# Altium schematic sheet Calculator_Sch.SchDoc
size A4; SheetNumber: 1; SheetTotal: 1
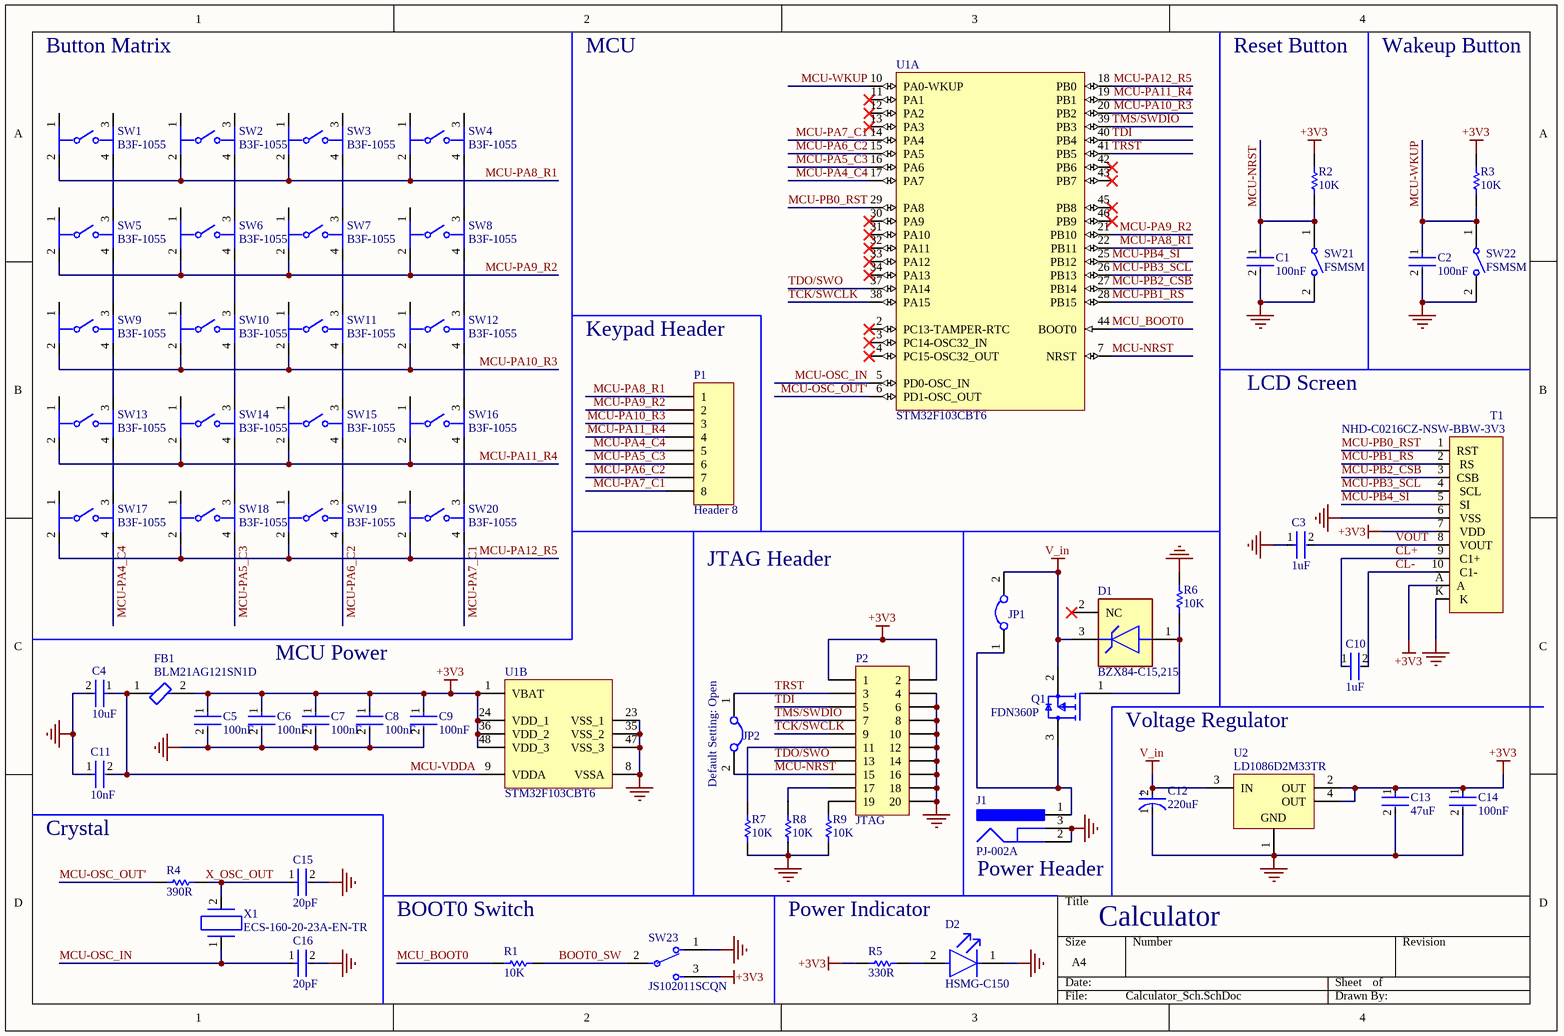
[diagram p0: Calculator_Sch.SchDoc]

## Parts
C1  100nF  [FP-C1206C-EB-MFG]
C2  100nF  [FP-C1206C-EB-MFG]
C3  1uF  [FP-1206-L_3_2_0_2-W_1_6_0-IPC_C]
C4  10uF  [FP-1206-L_3_2_0_2-W_1_6_0-IPC_B]
C5  100nF  [FP-C1206C-EB-MFG]
C6  100nF  [FP-C1206C-EB-MFG]
C7  100nF  [FP-C1206C-EB-MFG]
C8  100nF  [FP-C1206C-EB-MFG]
C9  100nF  [FP-C1206C-EB-MFG]
C10  1uF  [FP-1206-L_3_2_0_2-W_1_6_0-IPC_C]
C11  10nF  [FP-C1206C-EB-MFG]
C12  220uF  [FP-TAJE-MFG]
C13  47uF  [FP-C3216-160-0_2-MFG]
C14  100nF  [FP-C1206C-EB-MFG]
C15  20pF  [FP-C1206C-EB-MFG]
C16  20pF  [FP-C1206C-EB-MFG]
D1  BZX84-C15,215  [FP-SOT23-IPC_C]
D2  HSMG-C150  [FP-HSMG-C150-MFG]
FB1  BLM21AG121SN1D  [FP-BLM21-0_2-t0_85-e0_5-IPC_A]
J1  PJ-002A  [CUI-PJ-002A_V]
JP1  Jumper  [Jumper Small - 2.54 - GRAY]  (value not drawn)
JP2  Jumper  [Jumper Small - 2.54 - GRAY]  (value not drawn)
P1  Header 8  [HDR1X8]
P2  JTAG  [HDR2X10]
Q1  FDN360P  [FP-527AG-IPC_B]
R1  10K  [RESC3116X65X40ML10T20]
R2  10K  [RESC3116X65X40ML10T20]
R3  10K  [RESC3116X65X40ML10T20]
R4  390R  [RESC3216X60X45NL10T20]
R5  330R  [RESC3116X65X40LL10T20]
R6  10K  [RESC3116X65X40ML10T20]
R7  10K  [RESC3116X65X40ML10T20]
R8  10K  [RESC3116X65X40ML10T20]
R9  10K  [RESC3116X65X40ML10T20]
SW1  B3F-1055  [FP-B3F-1055-MFG]
SW2  B3F-1055  [FP-B3F-1055-MFG]
SW3  B3F-1055  [FP-B3F-1055-MFG]
SW4  B3F-1055  [FP-B3F-1055-MFG]
SW5  B3F-1055  [FP-B3F-1055-MFG]
SW6  B3F-1055  [FP-B3F-1055-MFG]
SW7  B3F-1055  [FP-B3F-1055-MFG]
SW8  B3F-1055  [FP-B3F-1055-MFG]
SW9  B3F-1055  [FP-B3F-1055-MFG]
SW10  B3F-1055  [FP-B3F-1055-MFG]
SW11  B3F-1055  [FP-B3F-1055-MFG]
SW12  B3F-1055  [FP-B3F-1055-MFG]
SW13  B3F-1055  [FP-B3F-1055-MFG]
SW14  B3F-1055  [FP-B3F-1055-MFG]
SW15  B3F-1055  [FP-B3F-1055-MFG]
SW16  B3F-1055  [FP-B3F-1055-MFG]
SW17  B3F-1055  [FP-B3F-1055-MFG]
SW18  B3F-1055  [FP-B3F-1055-MFG]
SW19  B3F-1055  [FP-B3F-1055-MFG]
SW20  B3F-1055  [FP-B3F-1055-MFG]
SW21  FSMSM  [TECO-FSMSM-2_V]
SW22  FSMSM  [TECO-FSMSM-2_V]
SW23  JS102011SCQN  [FP-JS102011SCQN-MFG]
T1  NHD-C0216CZ-NSW-BBW-3V3  [NHD-C0216CZ-NSW-BBW-3V3]
U1  STM32F103CBT6  [STM-LQFP48_L]  (parts A,B of 2)
U2  LD1086D2M33TR  [D2PAK_A_L]
X1  ECS-160-20-23A-EN-TR  [ECX-64AEN/64CEN]

## Nets
+3V3: C5.1 C6.1 C7.1 C8.1 C9.1 C13.1 C14.1 FB1.2 P2.1 P2.2 R2.2 R3.2 R5.1 SW23.3 T1.7(VDD) T1.A U1.1(VBAT) U1.24(VDD_1) U1.36(VDD_2) U1.48(VDD_3) U2.2(OUT) U2.4(OUT)
GND: C1.2 C2.2 C3.1 C4.2 C5.2 C6.2 C7.2 C8.2 C9.2 C11.1 C12.1(C) C13.2 C14.2 C15.2 C16.2 D2.1(C) J1.2 J1.3 P2.4 P2.6 P2.8 P2.10 P2.12 P2.14 P2.16 P2.18 P2.20 R6.1 R7.1 R8.1 R9.1 SW21.2 SW22.2 SW23.1 T1.6(VSS) T1.K U1.8(VSSA) U1.23(VSS_1) U1.35(VSS_2) U1.47(VSS_3) U2.1(GND)
V_in: C12.2(A) D1.3(C) JP1.2 Q1.2(S) U2.3(IN)
BOOT0_SW: R1.2 SW23.2(C)
CL+: C10.1 T1.9(C1+)
CL-: C10.2 T1.10(C1-)
MCU-NRST: C1.1 JP2.2 P2.15 R2.1 SW21.1 U1.7(NRST)
MCU-OSC_IN: C16.1 U1.5(PD0-OSC_IN) X1.1
MCU-OSC_OUT': R4.1 U1.6(PD1-OSC_OUT)
MCU-PA4_C4: P1.5 SW17.4 U1.17(PA7)
MCU-PA5_C3: P1.6 SW18.4 U1.16(PA6)
MCU-PA6_C2: P1.7 SW19.4 U1.15(PA5)
MCU-PA7_C1: P1.8 SW20.4 U1.14(PA4)
MCU-PA8_R1: P1.1 SW1.2 SW2.2 SW3.2 SW4.2 U1.22(PB11)
MCU-PA9_R2: P1.2 SW5.2 SW6.2 SW7.2 SW8.2 U1.21(PB10)
MCU-PA10_R3: P1.3 SW9.2 SW10.2 SW11.2 SW12.2 U1.20(PB2)
MCU-PA11_R4: P1.4 SW13.2 SW14.2 SW15.2 SW16.2 U1.19(PB1)
MCU-PA12_R5: SW17.2 SW18.2 SW19.2 SW20.2 U1.18(PB0)
MCU-PB0_RST: T1.1(RST) U1.29(PA8)
MCU-PB1_RS: T1.2(RS) U1.28(PB15)
MCU-PB2_CSB: T1.3(CSB) U1.27(PB14)
MCU-PB3_SCL: T1.4(SCL) U1.26(PB13)
MCU-PB4_SI: T1.5(SI) U1.25(PB12)
MCU-VDDA: C4.1 C11.2 FB1.1 U1.9(VDDA)
MCU-WKUP: C2.1 R3.1 SW22.1 U1.10(PA0-WKUP)
MCU_BOOT0: R1.1 U1.44(BOOT0)
TCK/SWCLK: P2.9 U1.38(PA15)
TDI: P2.5 U1.40(PB4)
TDO/SWO: P2.13 U1.37(PA14)
TMS/SWDIO: P2.7 U1.39(PB3)
TRST: JP2.1 P2.3 U1.41(PB5)
VOUT: C3.2 T1.8(VOUT)
X_OSC_OUT: C15.1 R4.2 X1.2
NetD1_1: D1.1(A) Q1.1(G) R6.2
NetD2_2: D2.2(A) R5.2
NetJ1_1: J1.1 JP1.1 Q1.3(D)
NetP2_11: P2.11 R7.2
NetP2_17: P2.17 R8.2
NetP2_19: P2.19 R9.2
NetSW1_4: SW1.4 SW5.3
NetSW2_4: SW2.4 SW6.3
NetSW3_4: SW3.4 SW7.3
NetSW4_4: SW4.4 SW8.3
NetSW5_4: SW5.4 SW9.3
NetSW6_4: SW6.4 SW10.3
NetSW7_4: SW7.4 SW11.3
NetSW8_4: SW8.4 SW12.3
NetSW9_4: SW9.4 SW13.3
NetSW10_4: SW10.4 SW14.3
NetSW11_4: SW11.4 SW15.3
NetSW12_4: SW12.4 SW16.3
NetSW13_4: SW13.4 SW17.3
NetSW14_4: SW14.4 SW18.3
NetSW15_4: SW15.4 SW19.3
NetSW16_4: SW16.4 SW20.3

Not connected (* = marked no-connect by the designer): D1 2(NC)*; SW1 1 3; SW2 1 3; SW3 1 3; SW4 1 3; SW5 1; SW6 1; SW7 1; SW8 1; SW9 1; SW10 1; SW11 1; SW12 1; SW13 1; SW14 1; SW15 1; SW16 1; SW17 1; SW18 1; SW19 1; SW20 1; U1 2(PC13-TAMPER-RTC)* 3(PC14-OSC32_IN)* 4(PC15-OSC32_OUT)* 11(PA1)* 12(PA2)* 13(PA3)* 30(PA9)* 31(PA10)* 32(PA11)* 33(PA12)* 34(PA13)* 42(PB6)* 43(PB7)* 45(PB8)* 46(PB9)*

## Notes on the sheet
- Button Matrix
- MCU
- Reset Button
- Wakeup Button
- Keypad Header
- LCD Screen
- JTAG Header
- MCU Power
- (near JP2) Default Setting: Open
- Voltage Regulator
- Crystal
- (near R1) BOOT0 Switch
- Power Indicator
- (near J1) Power Header
- Calculator
- (in symbol CMP-04424-000272-1) +

## Library data of the parts
C1 C2 C5-C9 C14 = CMP-03020-021070-1: CAP CER 0.1UF 16V 10% X7R 1206; Manufacturer Part Number: C1206C104K4RACTU; Manufacturer: KEMET; Automotive Grade: Grade 0; Tolerance: 0.1; Temperature Coefficient: 15%; Capacitance: 0.10 μF; Material: Ceramic; Value: 0.10 μF; ComponentLink2URL: https://content.kemet.com/datasheets/KEM_C1007_X8R_ULTRA_150C_SMD.pdf; Voltage Rating: 16 V; Temperature Range Low: -55°C; Device Class L3: Ceramic Capacitors; Device Class L1: Passive Components; Lead Free: Yes; Temperature Characteristic: X7R; Package: C1206C-EB; RoHS: TRUE; Ipc Land Pattern Name: CAPC320160X78; Automotive: Yes; Temperature: -55°C to +150°C; Category: Cap; Digikey Description: CAP CER 0.1UF 16V 10% X7R 1206; Mouser Description: Multilayer Ceramic Capacitors MLCC - SMD/SMT 16volts 0.1uF X7R 10%; ComponentLink2Description: Datasheet; Temperature Range High: +150°C; Device Class L2: Capacitors; Height: 0.88mm; Octopart: https://octopart.com/c1206c104k4ractu-kemet-12577600
C3 C10 = CMP-04427-011211-1: General Purpose Ceramic Capacitor, 1206, 1uF, 20%, X7R, 15%, 16V; Dissipation Factor: 3.5%; Contact Plating: Tin; Case Code (Imperial): 1206; Dielectric: X7R; Packaging: Tape and Reel; Case/Package: 1206; Min Operating Temperature: -55°C; Radiation Hardening: No; Length: 3.2mm; Termination: SMD/SMT; Number of Pins: 2; Lead Free: Lead Free; Case Code (Metric): 3216; Tolerance: 20%; Series: -; RoHS Compliant: Yes; Capacitance: 1uF; REACH SVHC: No SVHC; Max Operating Temperature: 125°C; Thickness: 0.05inch; Mount: Surface Mount; Depth: 1.6mm; Construction: Flat; Width: 1.6mm; Package Quantity: 1; Voltage Rating (DC): 16V; Voltage Rating: 16V
C4 = CMP-04427-000082-1: General Purpose Ceramic Capacitor, 1206, 10uF, 10%, X5R, 15%, 16V; Max Operating Temperature: 85°C; Tolerance: 10%; Dielectric: X5R; Series: -; Case Code (Imperial): 1206; Width: 1.6mm; Termination: SMD/SMT; Voltage Rating: 16V; REACH SVHC: No SVHC; Length: 3.2mm; Size: 1.78mm; Capacitance: 10uF; Package Quantity: 1; Voltage: 16V; RoHS Compliant: Yes; Thickness: 0.07inch; Mount: Surface Mount; Radiation Hardening: No; Voltage Rating (DC): 16V; Min Operating Temperature: -55°C; Case Code (Metric): 3216; Construction: Flat; Depth: 1.6mm; Height: 0.07mm; Lead Free: Lead Free; Number of Pins: 2; Case/Package: 1206; Packaging: Tape and Reel
C11 = CMP-1037-03529-2: CAP CER 10000PF 200V X7R 1206; Manufacturer: KEMET; Manufacturer Part Number: C1206C103K2RACTU; Value: 10,000 pF; Automotive Grade: Grade 0; Temperature Coefficient: 15%; Material: Ceramic; Tolerance: 0.1; Temperature Range High: +150°C; Category: Cap; Device Class L2: Capacitors; Temperature Range Low: -55°C; Temperature Characteristic: X7R; Lead Free: Yes; Octopart: https://octopart.com/c1206c103k2ractu-kemet-2299149; Device Class L1: Passive Components; RoHS: TRUE; Mouser Description: Multilayer Ceramic Capacitors MLCC - SMD/SMT 200volts 10000pF X7R 10%; Temperature: -55°C to +150°C; Voltage Rating: 200 V; ComponentLink2URL: https://content.kemet.com/datasheets/KEM_C1007_X8R_ULTRA_150C_SMD.pdf; Ipc Land Pattern Name: CAPC320160X78; Automotive: Yes; Device Class L3: Ceramic Capacitors; Digikey Description: CAP CER 10000PF 200V X7R 1206; Capacitance: 10,000 pF; Package: C1206C-EB; ComponentLink2Description: Datasheet; Height: 0.88mm
C12 = CMP-04424-000272-1: 220uF 16V  ±20% 500mΩ 2917  SMD Tantalum Capacitor; ESR (Equivalent Series Resistance): 500mR; Polarity: Polar; Leakage Current: 35.2uA; Dissipation Factor: 10%; Width: 4.3mm; Depth: 4.3mm; Termination: SMD/SMT; Radiation Hardening: No; RoHS Compliant: Yes; Mount: Surface Mount; Packaging: Tape and Reel; Voltage Rating (DC): 16V; Tolerance: 20%; Features: General Purpose; Case Code (Imperial): 2917; Lead Free: Lead Free; REACH SVHC: No SVHC; Series: TAJ; Voltage Rating: 16V; Construction: Flat; Number of Pins: 2; Length: 7.3mm; Capacitance: 220uF; Min Operating Temperature: -55°C; Package Quantity: 1; Max Operating Temperature: 125°C; Case/Package: 2917; Height - Seated (Max): 0.169inch; Case Code (Metric): 7343; Height: 4.3mm
C13 = CMP-2000-07442-2: Multilayer Ceramic Capacitors 47uF ±20% 16V X5R SMD 1206; Resistor Type: Ceramic; Width: 0.063inch; Case Code (Imperial): 1206; Radiation Hardening: No; Thickness: 0.071inch; Dielectric: X5R; Weight: 0.000571oz; Termination: SMD/SMT; Dielectric Material: Ceramic; Min Operating Temperature: -55°C; Depth: 1.6mm; Case Code (Metric): 3216; Max Operating Temperature: 85°C; RoHS Compliant: Yes; REACH SVHC: No SVHC; Mount: Surface Mount; Lead Free: Lead Free; Height: 1.6mm; Length: 3.2mm; Tolerance: 20%; Voltage Rating (DC): 16V; Capacitance: 47uF; Package Quantity: 1; Construction: Flat; Packaging: Tape and Reel; Series: C; Case/Package: 1206; Voltage Rating: 16V
C15 C16 = CMP-1037-00940-2: 1206 C 20pF Ceramic Multilayer Capacitor; 50 VDC; +125degC; C0G Dielec; +/-5%; Manufacturer: KEMET; Manufacturer Part Number: C1206C200J5GACTU; Temperature Coefficient: 15%; Automotive Grade: Grade 0; Voltage Rating: 50 V; Tolerance: 0.05; Material: Ceramic; Category: Cap; Mouser Description: 1206 C 20pF Ceramic Multilayer Capacitor; 50 VDC; +125degC; C0G Dielec; +/-5%; Device Class L1: Passive Components; Digikey Description: 1206 C 20pF Ceramic Multilayer Capacitor; 50 VDC; +125degC; C0G Dielec; +/-5%; RoHS: TRUE; ComponentLink2URL: https://content.kemet.com/datasheets/KEM_C1007_X8R_ULTRA_150C_SMD.pdf; Lead Free: Yes; Capacitance: 20 pF; Ipc Land Pattern Name: CAPC320160X78; Temperature Range High: +150°C; ComponentLink2Description: Datasheet; Value: 20 pF; Device Class L3: Ceramic Capacitors; Height: 0.88mm; Automotive: Yes; Temperature Range Low: -55°C; Temperature Characteristic: C0G; Device Class L2: Capacitors; Octopart: https://octopart.com/c1206c200j5gactu-kemet-139653; Package: C1206C-EB; Temperature: -55°C to +150°C
D1 = CMP-14400-000028-1: DIODE ZENER 15V 250MW TO236AB
D2 = CMP-2000-05061-2: LED GREEN DIFFUSED 1206 SMD; Manufacturer: Broadcom; Led Orientation: Top View; Max Junction Temp: +95°C; Peak Emmision Wavelength: 570nm; Viewing Angle: 170°; Wavelength: 572nm; Reverse Voltage: 5V; Luminous Intensity: 15mcd; Description: Surface Mount Chip LEDs; Forward Voltage: 2.2V; Power Dissipation: 65mW; Forward Current: 20mA; ComponentLink2Description: Datasheet; Lead Free: Yes; Temperature Range Low: -40°C; Package: HSMG-C150; Digikey Description: LED GREEN DIFFUSED 1206 SMD; Mouser Description: LED Uni-Color Green 570nm 2-Pin Chip LED T/R; Manufacturer Part Number: HSMG-C150; Temperature Range High: +85°C; Device Class L1: Optoelectronics; Colour: Green; Category: Diode; Device Class L3: unset; RoHS: TRUE; Height: 1.2mm; ComponentLink2URL: https://docs.broadcom.com/docs/AV02-0551EN; Device Class L2: LEDs; Automotive: No; Ipc Land Pattern Name: DIOCP320160X55; Octopart: https://octopart.com/hsmg-c150-broadcom-71131304; Temperature: -40°C to +85°C
FB1 = CMP-0686-00716-3: FERRITE BEAD 120 OHM 0805 1LN; Number of Lines: 1; DC Resistance-Max: 100mR; Material: Steel; Max DC Current: 200mA; Shielding: Unshielded; Test Frequency: 100MHz; Impedance: 120R; Current Rating: 800mA; Max Current Rating: 1A; Resistance: 150mR; Tolerance: 25%; Width: 1.25mm; Number of Circuits: 1; Military Standard: Not; Height: 0.85mm; Series: BLM21A; Min Operating Temperature: -55°C; DC Resistance (DCR): 100mR; Termination: SMD/SMT; Core Material: Ferrite; REACH SVHC: No SVHC; Radiation Hardening: No; Max Operating Temperature: 125°C; Number of Pins: 2; Case/Package: 0805; Case Code (Imperial): 0805; Frequency: 100MHz; Depth: 1.25mm; Length: 2mm; DC Current: 200mA; Lead Free: Lead Free; Case Code (Metric): 2012; Package Quantity: 1; Packaging: Tape and Reel
J1 = CMP-2000-06895-2: Through Hole Right Angle DC Power Jack, 2.5 A, 2 mm Center Pin, 3 Position, -25 to 85 degC, RoHS, Bulk; Manufacturer: CUIInc.; Brand: CUI; Inside Contact Diameter: 2mm; Voltage Rating: 24V; Outside Contact Diameter: 6.5mm; Current Rating: 2.5A; Insulation Resistance: 50MOhms; Contact Gender: Male; Connector Type: DCPowerJack; Datasheet Version: Rev. 1.03, 04/2016; Housing Material: PolybutyleneTerephthalate(PBT); Operating Temperature Range: -25Cto+85C; Termination Style: ThroughHole; Product Category: DCPowerConnectors; Mounting Technology: ThroughHole; Mounting Style: ThroughHole; Factory Pack Quantity: 500; Contact Plating: Nickel; Package Reference: PJ-002A; Mounting Angle: Right; Package Description: 3-Pin Through Hole Device, Body 14.4 x 9 mm, Height 11 mm; Flammability Rating: UL94V-0; Manufacturer URL: http://www.cui.com/; Product: Jacks; Contact Material: Copper; Datasheet URL: http://www.cui.com/product/resource/pj-002a.pdf; RoHS: True
JP1 JP2 = Jumper: Company: E.P.I.L; Defualt State: Close; Design Date: 2011/11/02
P1 = Header 8: Header, 8-Pin; LatestRevisionDate: 17-Jul-2002; LatestRevisionNote: Re-released for DXP Platform.; Publisher: Altium Limited
P2 = Header 10X2: Header, 10-Pin, Dual row; LatestRevisionDate: 17-Jul-2002; LatestRevisionNote: Re-released for DXP Platform.; Publisher: Altium Limited
Q1 = CMP-2000-07455-3: MOSFET P-CH 30V 2A SSOT3; Gate to Source Voltage (Vgs): 20V; Turn-On Delay Time: 6ns; Number of Elements: 1; Max Power Dissipation: 500mW; Rds On Max: 80mR; Input Capacitance: 298pF; Current Rating: -2A; Dual Supply Voltage: -30V; Element Configuration: Single; Turn-Off Delay Time: 11ns; Drain to Source Resistance: 63mR; Rise Time: 13ns; REACH SVHC: No SVHC; Radiation Hardening: No; Packaging: Tape and Reel; Mount: Surface Mount; Height: 0.94mm; Power Dissipation: 500mW; Case/Package: SOT-23; Width: 1.4mm; Continuous Drain Current (ID): 2A; Lead Free: Lead Free; Package Quantity: 1; Drain to Source Voltage (Vdss): 30V; Weight: 0.03g; Voltage Rating (DC): -30V; Threshold Voltage: 20V; On-State Resistance: 80MR; Number of Pins: 3; Drain to Source Breakdown Voltage: -30V; Max Operating Temperature: 150°C; Contact Plating: Tin; Length: 2.92mm; Min Operating Temperature: -55°C; Fall Time: 6ns
R1-R3 R6-R9 = CMP-1014-00623-2: Chip Resistor, 10 KOhm, +/- 1%, 0.25 W, -55 to 155 degC, 1206 (3216 Metric), RoHS, Tape and Reel; Manufacturer: Yageo; Voltage Rating: 200V; Resistance: 10KOhm; Temperature Coefficient: 100ppm/degreesC; Power Rating: 250mW; Packaging: TapeandReel; Termination: SMD/SMT; REACH SVHC: Unknown; Tolerance: 1%; Height: 0.55mm; Composition: ThickFilm; Max Operating Temperature: 155degC; Datasheet Version: Rev. 5, 10/2016; Lead Free: LeadFree; Case Code (Metric): 3216; Depth: 1.6mm; Package Quantity: 5000; RoHSCompliant: true; Military Standard: Not; Case/Package: 1206; Case Code (Imperial): 1206; Min Operating Temperature: -55degC; Datasheet URL: http://www.yageo.com/NewPortal/yageodocoutput?fileName=/pdf/R-Chip/PYu-RC_Group_51_RoHS_L_5.pdf; Length: 3.1mm; Manufacturer URL: http://www.yageo.com/; Package Reference: 1206.0; Width: 1.6mm; Package Description: 2-Pin Surface Mount Device, Body 3.1 x 1.6 mm
R4 = CMP-2003-02135-1: Manufacturer: Vishay Dale; Part Number: CRCW1206390RJNEA
R5 = CMP-2000-06969-1: Chip Resistor, 330 Ohm, +/- 1%, 250 mW, -55 to 155 degC, 1206 (3216 Metric), RoHS, Tape and Reel; Manufacturer: Yageo; Voltage Rating: 200V; Power Rating: 250mW(1/4W); Resistance: 330Ohms; Temperature Coefficient: 100PPM/C; Product: ThickFilmResistorsGeneralPurpose; Operating Temperature Range: -55Cto+155C; Datasheet Version: Rev. 7, 05/2017; Case Code - in: 1206; Package Reference: 1206; Termination Style: SMD/SMT; Manufacturer URL: http://www.yageo.com/; Package Description: 2-Pin Surface Mount Device, Body 3.1 x 1.6 mm; Packaging: Reel; Tolerance: 1%; Mounting Technology: SurfaceMount; Case Code - mm: 3216; Datasheet URL: http://www.yageo.com/documents/recent/PYu-RC_Group_51_RoHS_L_7.pdf; Series: RC
SW1-SW20 = CMP-08834-000061-1: SWITCH TACTILE SPST-NO 0.05A 24V; Switch Travel: 0.25mm; Mechanical Life: 100000Cycles; Max Current Rating: 50mA; Actuator Color: Orange; Throw Configuration: SPST; Switch Function: Off-Mom; Contact Resistance: 100mR; Number of Poles: 1; Operating Force: 2.55N; Illumination Type: Non-Illuminated; Electrical Life: 300000Cycles; Actuator Length: 3mm; Termination: PC Pins; Contact Plating: Silver; Depth: 6mm; Max Voltage Rating (DC): 24V; Voltage Rating (DC): 24V; Package Quantity: 1500; Lead Free: Lead Free; Min Operating Temperature: -25°C; Max Operating Temperature: 70°C; Mount: Through Hole; Series: B3F; Contact Current Rating: 50mA; Orientation: Straight; Width: 6mm; RoHS Compliant: Yes; Contact Type: 1 maker; Weight: 0.25g; Packaging: Bag; Contact Material: Gold; Length: 6mm; Height: 7.3mm; Current Rating: 50mA; Supplier: Digi-Key; Supplier Part Number: SW795-ND
SW21 SW22 = CMP-2000-07511-1: FSMSM Push Button Switch, 50 mA, -35 to 85 degC, 2-Pin SMD, RoHS, Bulk; Manufacturer: TE Connectivity; Actuator Length: 1.07mm; Electrical Life: 20000Cycles; Actuator Material: Polyamide; Current Rating: 50mA; Illumination Type: Illuminated; Voltage Rating (DC): 24V; Contact Resistance: 100mOhm; Case\/Package: SMD/SMT; Operating Force: 180gf; Switch Travel: 0.25mm; Max Voltage Rating (DC): 12V; Throw Configuration: SPST; Packaging: LoosePiece; Max Operating Temperature: 85degC; ELV: Compliant; Package Description: 2-Pin Surface Mount Device, Body 6 x 3.5 mm, Pitch 9.19 mm; RoHSCompliant: true; Manufacturer URL: http://www.te.com/; Contact Plating: Silver; Contact Material: Brass; Mounting Technology: SurfaceMount; Contact Current Rating: 50mA; Datasheet Version: Rev. C2, 08/2014; Datasheet URL: http://www.te.com/commerce/DocumentDelivery/DDEController?Action=showdoc&DocId=Customer+Drawing%7F1437566-3%7FC2%7Fpdf%7FEnglish%7FENG_CD_1437566-3_C2_1437566_3_1_c.dwg.pdf%7F1437566-3; Mechanical Life: 20000Cycles; Package Reference: FSMSM; REACH SVHC: Unknown; Orientation: Straight; Min Operating Temperature: -35degC; Lead Free: LeadFree; Termination: GullWing; Package Quantity: 1000; Mount: SurfaceMount
SW23 = CMP-10038-000023-1: SWITCH SLIDE SPDT 300MA 6V; Electrical Life: 5000Cycles; Actuator Type: Standard; Contact Resistance: 70mR; Actuator Material: Nylon; Max Voltage Rating (DC): 30V; Actuator Length: 2mm; Switch Function: On-On; Actuator Color: Black; Radiation Hardening: No; Throw Configuration: SPDT; Depth: 7.5mm; Case/Package: SMD/SMT; Package Quantity: 4000; Min Operating Temperature: -40°C; Length: 8.5mm; Current Rating: 300mA; Mount: Surface Mount; Voltage Rating (DC): 6V; RoHS Compliant: Yes; Orientation: Straight; Housing Material: Nylon; Contact Plating: Silver; Max Operating Temperature: 85°C; Packaging: Tape and Reel; Switch Travel: 2mm; Max Current Rating: 300mA; Contact Material: Copper Alloy; Series: JS; Termination: Gull Wing
T1 = NHD-C0216CZ-NSW-BBW-3V3: LCD MOD 32DIG 16X2 TRANSMISV WHT; Supplier 1: Digi-Key; Supplier Part Number 1: NHD-C0216CZ-NSW-BBW-3V3-ND
U1 = CMP-0237-00250-3: ARM Cortex-M3 32-bit MCU, 128 KB Flash, 20 KB Internal RAM, 37 I/Os, 48-pin LQFP, -40 to 85 degC, Tray; Supply Voltage(Vcc) min (V): 2; Operating Frequency(F) (Processor speed) (MHz): 72; A/D Converter: 2x12-bit (10 Channel); FLASH Size (Prog) (kB): 128; Internal RAM Size (kB): 20; I/Os (High Current): 37; ComponentLink2Description: Datasheet; PackageReference: LQFP48; PartNumber: STM32F103CBT6; ComponentLink1Description: Manufacturer URL; DatasheetVersion: Rev. 16; PackageVersion: Rev. 6, 06/2013; Packing: Tray; ComponentLink1URL: http://www.st.com/web/en/home.html; Mounting Technology: Surface Mount; ComponentLink3URL: http://www.st.com/st-web-ui/static/active/en/resource/technical/document/datasheet/DM00058181.pdf; PackageDescription: 48-Pin Low Profile Quad Flat Package, 7 x 7 mm Body, 0.5 mm Pitch; Core: ARM Cortex-M3; ComponentLink3Description: Package Specification; ComponentLink2URL: http://www.st.com/st-web-ui/static/active/en/resource/technical/document/datasheet/CD00161566.pdf
U2 = CMP-0244-00505-1: 1.5A, Low Drop Positive Voltage Regulator, 3.3V, 4-Pin D2PAK/A, Tape and Reel; PackageDescription: 4-Pin Transistor Outline Package 2.54 mm Pitch, 15.4 mm Lead Span; DatasheetVersion: 11/07/2011; PackageReference: D2PAK_A; ComponentLink1Description: Manufacturer URL; ComponentLink2Description: Datasheet; PackageVersion: 2011; ComponentLink2URL: http://www.st.com/internet/com/TECHNICAL_RESOURCES/TECHNICAL_LITERATURE/DATASHEET/CD00001884.pdf; ComponentLink1URL: http://www.st.com
X1 = ECS-160-20-23A-EN-TR: CRYSTAL 16.0000MHZ 20PF SMD; Supplier 1: Newark; Supplier Part Number 1: 54AK5822